# Altium schematic sheet Voltage_Bridge.SchDoc
size 99 x 48 mm
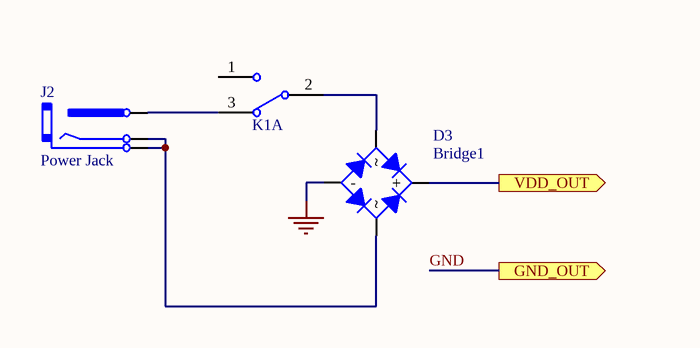
[diagram p0: Voltage_Bridge.SchDoc]

## Parts
D3  Bridge1  [BRIDGE-2]
J2  Power Jack  [KLD-0202]
K1  SW DPDT_2  [DPDT-6_2]  (value not drawn)  (part A of 2)

## Ports
GND_OUT (out), VDD_OUT (out)

## Nets
GND: D3.1(-) ; port GND_OUT
VDD_OUT: D3.3(+) ; port VDD_OUT
NetD3_2: D3.2 K1.2(COMMON)
NetD3_4: D3.4 J2.2(A) J2.3(B)
NetJ2_1: J2.1(A) K1.3(NC)

Not connected (* = marked no-connect by the designer): K1 1(NO)

## Library data of the parts
D3 = Bridge1: Full Wave Diode Bridge; Manufacturer: Generic Components; Class I: Discrete; Class II: Rectifier - Bridge; Published: 8-Jun-2000; Revision: July-2002: Re-released for DXP Platform.; Publisher: Altium Limited
K1 = SW DPDT_2: Single-Pole, Double-Throw Switch, Key; Manufacturer: Generic Components; Published: 24-Mar-1999; Revision: July-2002: Re-released for DXP Platform.; Publisher: Altium Limited